# EAGLE design leaf_ard_rev_A (EAGLE 7.3.0)
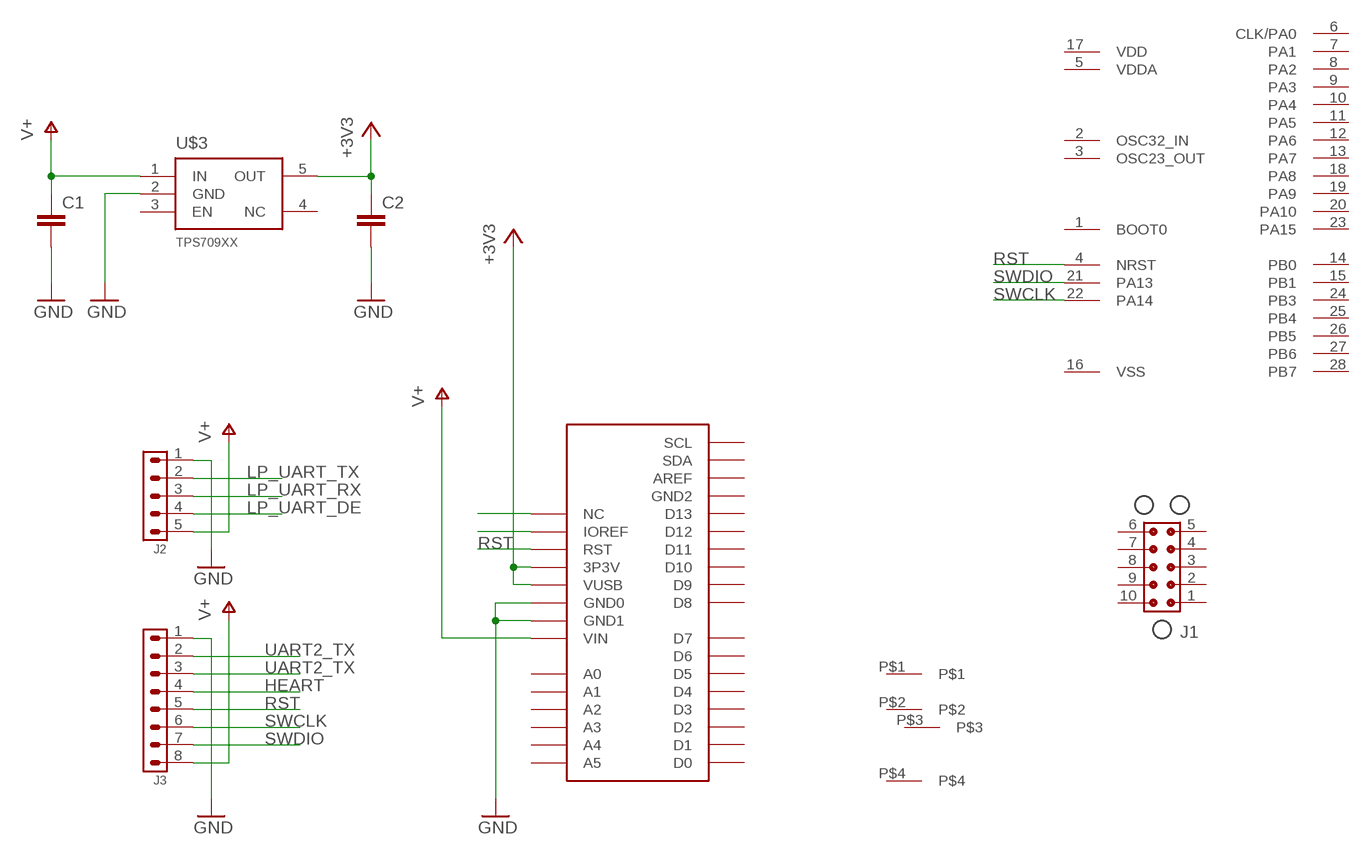
[diagram p0: schematic, sheet 1]

## Parts
C1  0603_CAP  [0603]
C2  0603_CAP  [0603]
J1  TC_2050_IDC_NL_TOP  [TC_2050_IDC_NL_TOP]
J2  CONN_5X1_JST_PA  [CONN_5X1_JST_PA]
J3  CONN_8X1_JST_PA  [CONN_8X1_JST_PA]
U1  STM32L031G6U6  [STM32_QFN_28_4X4]
U$1  ARDUINO_UNO_R3  [ARDUINO_UNO_R3]
U$2  BMI-S-103  [BMI-S-103]
U$3  TPS709XX  [SOT23-5]

## Nets
+3V3: C2.P$1 U$1.P03(3P3V) U$1.P04(VUSB) U$3.5(OUT)
GND: C1.P$2 C2.P$2 J2.1 J3.1 U$1.P05(GND0) U$1.P06(GND1) U$3.2(GND)
HEART: J3.4
LP_UART_DE: J2.4
LP_UART_RX: J2.3
LP_UART_TX: J2.2
RST: J3.5 U1.4(NRST) U$1.P02(RST)
SWCLK: J3.6 U1.22(PA14) U$1.P01(IOREF)
SWDIO: J3.7 U1.21(PA13) U$1.P00(NC)
UART2_TX: J3.2 J3.3
V+: C1.P$1 J2.5 J3.8 U$1.P07(VIN) U$3.1(IN)
Unconnected: J1.1 J1.2 J1.3 J1.4 J1.5 J1.6 J1.7 J1.8 J1.9 J1.10 U1.1(BOOT0) U1.2(OSC32_IN) U1.3(OSC23_OUT) U1.5(VDDA) U1.6(CLK/PA0) U1.7(PA1) U1.8(PA2) U1.9(PA3) U1.10(PA4) U1.11(PA5) U1.12(PA6) U1.13(PA7) U1.14(PB0) U1.15(PB1) U1.16(VSS) U1.17(VDD) U1.18(PA8) U1.19(PA9) U1.20(PA10) U1.23(PA15) U1.24(PB3) U1.25(PB4) U1.26(PB5) U1.27(PB6) U1.28(PB7) U$1.P10(A0) U$1.P11(A1) U$1.P12(A2) U$1.P13(A3) U$1.P14(A4) U$1.P15(A5) U$1.P20(D0) U$1.P21(D1) U$1.P22(D2) U$1.P23(D3) U$1.P24(D4) U$1.P25(D5) U$1.P26(D6) U$1.P27(D7) U$1.P30(D8) U$1.P31(D9) U$1.P32(D10) U$1.P33(D11) U$1.P34(D12) U$1.P35(D13) U$1.P36(GND2) U$1.P37(AREF) U$1.P38(SDA) U$1.P39(SCL) U$2.P$1 U$2.P$2 U$2.P$3 U$2.P$4 U$3.3(EN) U$3.4(NC)

## Library data of the parts
C1 C2 = stepOSP:0603_CAP
J1 = leaf:TC_2050_IDC_NL_TOP
J2 = leaf:CONN_5X1_JST_PA
J3 = leaf:CONN_8X1_JST_PA
U1 = leaf:STM32L031G6U6
U$1 = stepOSP:ARDUINO_UNO_R3
U$2 = stepOSP:BMI-S-103
U$3 = stepOSP:TPS709XX

## Board
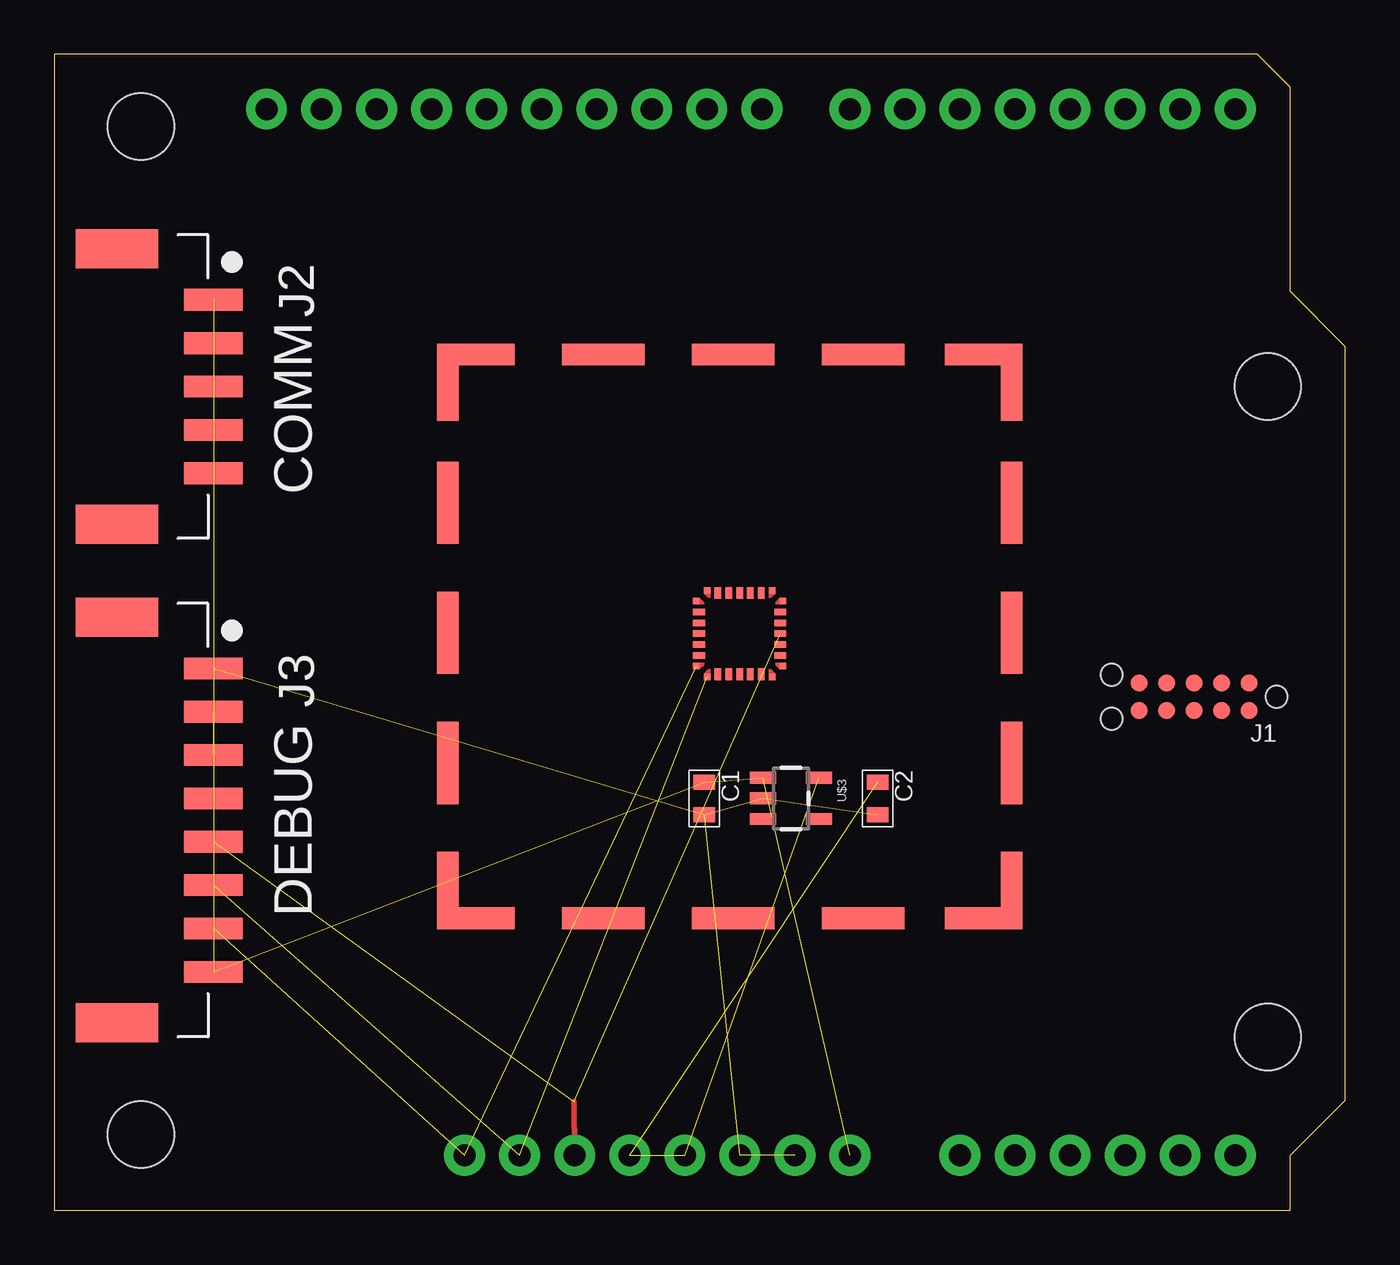
[diagram p1: board, top side]

Size 59.58 x 53.33 mm. Coordinates in mm from the lower left corner, seen from the top.
Outline: 0,0 57.04,0 57.04,2.54 59.58,5.08 59.58,39.85 57.04,42.39 57.04,51.82 55.52,53.33 0,53.33 0,0
Copper layers (1*16): Top 0.035mm / dielectric 1.5mm / Bottom 0.035mm
Design rules "default": minimum track width 10mil, minimum drill 24mil, track to track 8mil, track to pad 8mil, pad to pad 8mil, via to via 8mil, smd to smd 8mil, copper to edge 40mil, drill to drill 8mil, minimum pad ring 10mil, minimum via ring 8mil, stop-mask expansion 4mil, vias tented up to drill 0mil, thermal gap 10mil
Holes 3.05 mm at 4,50 4,3.5 56,8 56,38
tKeepout: area 1,47 to 7,53; area 53,35 to 59,41; area 53,5 to 59,11; area 1,0.5 to 7,6.5

### Footprints (pad centres in the part's own frame; a part is rotated, then mirrored left to right if it is on the bottom)
0603 = smd 0.7 x 1: P$1 -0.75,0; P$2 0.75,0
TC_2050_IDC_NL_TOP = smd 0.787 x 0.787: 1 1.27,-0.635; 2 2.54,-0.635; 3 3.81,-0.635; 4 5.08,-0.635; 5 6.35,-0.635; 6 6.35,0.635; 7 5.08,0.635; 8 3.81,0.635; 9 2.54,0.635; 10 1.27,0.635 | hole 0.991: 0,0; 7.62,1.016; 7.62,-1.016
CONN_5X1_JST_PA = smd 1 x 2.7: 1 4,-9.15; 2 2,-9.15; 3 0,-9.15; 4 -2,-9.15; 5 -4,-9.15 | smd 1.8 x 3.8: P$1 6.35,-4.7; P$2 -6.35,-4.7
CONN_8X1_JST_PA = smd 1 x 2.7: 1 7,-9.15; 2 5,-9.15; 3 3,-9.15; 4 1,-9.15; 5 -1,-9.15; 6 -3,-9.15; 7 -5,-9.15; 8 -7,-9.15 | smd 1.8 x 3.8: P$1 9.35,-4.7; P$2 -9.35,-4.7
STM32_QFN_28_4X4 = smd 0.3 x 0.3: 1 -2,1.5; 7 -2,-1.5; 8 -1.5,-2; 14 1.5,-2; 15 2,-1.5; 21 2,1.5; 22 1.5,2; 28 -1.5,2 | smd 0.55 x 0.3: 2 -1.875,1; 3 -1.875,0.5; 4 -1.875,0; 5 -1.875,-0.5; 6 -1.875,-1; 16 1.875,-1; 17 1.875,-0.5; 18 1.875,0; 19 1.875,0.5; 20 1.875,1 | smd 0.3 x 0.55: 9 -1,-1.875; 10 -0.5,-1.875; 11 0,-1.875; 12 0.5,-1.875; 13 1,-1.875; 23 1,1.875; 24 0.5,1.875; 25 0,1.875; 26 -0.5,1.875; 27 -1,1.875
ARDUINO_UNO_R3 = drill 1.016 pad 1.88: P00 27.94,2.54; P01 30.48,2.54; P02 33.02,2.54; P03 35.56,2.54; P04 38.1,2.54; P05 40.64,2.54; P06 43.18,2.54; P07 45.72,2.54; P10 50.8,2.54; P11 53.34,2.54; P12 55.88,2.54; P13 58.42,2.54; P14 60.96,2.54; P15 63.5,2.54; P20 63.5,50.8; P21 60.96,50.8; P22 58.42,50.8; P23 55.88,50.8; P24 53.34,50.8; P25 50.8,50.8; P26 48.26,50.8; P27 45.72,50.8; P30 41.656,50.8; P31 39.116,50.8; P32 36.576,50.8; P33 34.036,50.8; P34 31.496,50.8; P35 28.956,50.8; P36 26.416,50.8; P37 23.876,50.8; P38 21.336,50.8; P39 18.796,50.8
BMI-S-103 = smd 1 x 3.8: P$1 0.5,7.67; P$2 0.5,13.67; P$3 0.5,19.67; P$11 26.51,19.67; P$12 26.51,13.67; P$13 26.51,7.67 | smd 2.57 x 1: P$4 2.285,0.5; P$14 24.725,26.51 | smd 1 x 3.57: P$5 0.5,1.785; P$15 26.51,25.225 | smd 3.8 x 1: P$6 19.67,0.5; P$7 13.67,0.5; P$8 7.67,0.5; P$16 7.67,26.51; P$17 13.67,26.51; P$18 19.67,26.51 | smd 1 x 2.57: P$9 26.51,2.285; P$19 0.5,24.725 | smd 3.57 x 1: P$10 25.225,0.5; P$20 1.785,26.51
SOT23-5 = smd 0.55 x 1.2: 1 -0.95,-1.3; 2 0,-1.3; 3 0.95,-1.3; 4 0.95,1.3; 5 -0.95,1.3

### Placement (x,y rotation side)
C1  30,19 270 top
C2  38,19 270 top
J1  56.41,23.69 180 top
J2  -1.8,38 90 top
J3  -1.8,18 90 top
U1  31.63,26.6 180 top
U$1  -9,0 0 top
U$2  17.67,12.97 0 top
U$3  34,19 270 top

### Tracks (layer width: path | path; a pad name or v marks a point on that pad's centre or on a via)
+3V3  (3 unrouted)
GND  (6 unrouted)
RST  (2 unrouted)
  Top 0.254: U$1.P02 24,5
SWCLK  (2 unrouted)
SWDIO  (2 unrouted)
UART2_TX  (1 unrouted)
V+  (4 unrouted)

### Text on the board
tPlace: COMM | DEBUG